# EAGLE schematic temp sensor (EAGLE 9.5.2)
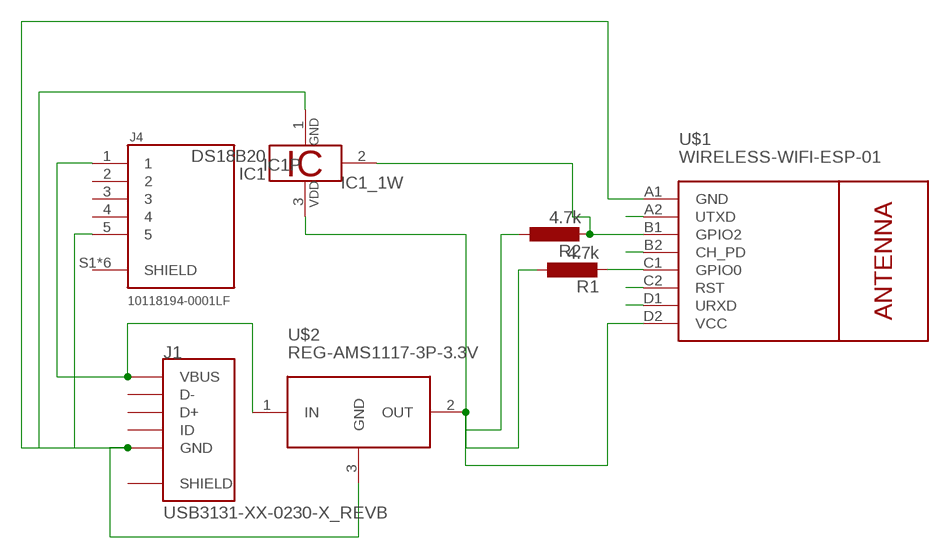
[diagram p0: schematic, sheet 1]

## Parts
IC1  DS18B20  [TO92-]
J1  USB3131-XX-0230-X_REVB  [GCT_USB3131-XX-0230-X_REVB]
J4  10118194-0001LF  [AMPHENOL_10118194-0001LF]
R1  4.7k  L-EU0207/10  [0207/10]
R2  4.7k  L-EU0207/10  [0207/10]
U$1  WIRELESS-WIFI-ESP-01  [WIRELESS-WIFI-ESP-01]
U$2  REG-AMS1117-3P-3.3V  [REG-AMS1117-3P]

## Nets
3.3V: IC1.3 R1.1 R2.1 U$1.D2(VCC) U$2.2(OUT)
5V: J1.1(VBUS) J4.1 U$2.1(IN)
CHP: U$1.B2(CH_PD)
GND: IC1.1 J1.5(GND) J4.5 U$1.A1(GND) U$2.3(GND)
GPIO0: R1.2 U$1.C1(GPIO0)
GPIO2: IC1.2 R2.2 U$1.B1(GPIO2)
RST: U$1.C2(RST)
RX: U$1.D1(URXD)
TX: U$1.A2(UTXD)
Unconnected: J1.2(D-) J1.3(D+) J1.4(ID) J1.6(SHIELD) J1.7(SHIELD) J4.2 J4.3 J4.4 J4.S1(SHIELD) J4.S2(SHIELD) J4.S3(SHIELD) J4.S4(SHIELD) J4.S5(SHIELD) J4.S6(SHIELD)

## Library data of the parts
IC1 = 1wire:DS18B20: Programmable Resolution Digital Thermometer This chip provides a onewire thermosensor with approx. 0.5°C accuracy. A programmable over/undertemperure alarm is available. The precision can be set from 9..12 bits. Notes: Vdd must be applied for accurate measurements at low temperatures, as the parasite power circuit otherwise heats the sensor. If parasite power is used, Vdd has to be connected to GND. The DS1822 is a low-cost thermometer chip, the DS18S20 is similar to the DS18B20, but with 9 Bit precision only. Author: Jan Kandziora <jjj@gmx.de>
J1 = USB3131-XX-0230-X_REVB:USB3131-XX-0230-X_REVB: Micro USB Receptacle, Type B, Through-Hole, Vertical, With 2.30mm (Standart) Shell Stakes; DESCRIPTION: USB - micro B USB 2.0 Receptacle Connector 5 Position Through Hole; DIGI-KEY_PART_NUMBER: 2073-USB3131-30-0230-ACT-ND; DIGI-KEY_PURCHASE_URL: https://www.digikey.com/product-detail/en/gct/USB3131-30-0230-A/2073-USB3131-30-0230-ACT-ND/9859713?utm_source=snapeda&utm_medium=aggregator&utm_campaign=symbol; MF: Global Connector Technology; MP: USB3131-30-0230-A; PACKAGE: None
J4 = 10118194-0001LF.3:10118194-0001LF: Micro Usb, 2.0 Type b, Rcpt, Smt; DESCRIPTION: USB - micro B USB 2.0 Receptacle Connector 5 Position Surface Mount, Right Angle; Through Hole; DIGI-KEY_PART_NUMBER: 609-4618-1-ND; DIGI-KEY_PURCHASE_URL: https://www.digikey.com/product-detail/en/amphenol-icc-fci/10118194-0001LF/609-4618-1-ND/2785382?utm_source=snapeda&utm_medium=aggregator&utm_campaign=symbol; MF: Amphenol ICC; MP: 10118194-0001LF; PACKAGE: None
R1 R2 = resistor:L-EU: INDUCTOR, European symbol
U$1 = diy-modules:WIRELESS-WIFI-ESP-01: Wireless Wi-Fi ESP-01 Module based on ESP8266 chip Click here to find device on ebay.com <http://www.ebay.com/sch/esp8266+esp+01+transceiver>
U$2 = diy-modules:REG-AMS1117-3P-*: Linear Regulator based on AMS1117 chip 3-pin version AMS1117 datasheet is available here: http://www.advanced-monolithic.com/pdf/ds1117.pdf Click here to find device on ebay.com <http://www.ebay.com/sch/ams1117+module> Note: There are many variants. Search for the proper version.

## Net classes
0 default: clearance 0.205 mm